# EAGLE design horizontal_driver (EAGLE 8.5.2)
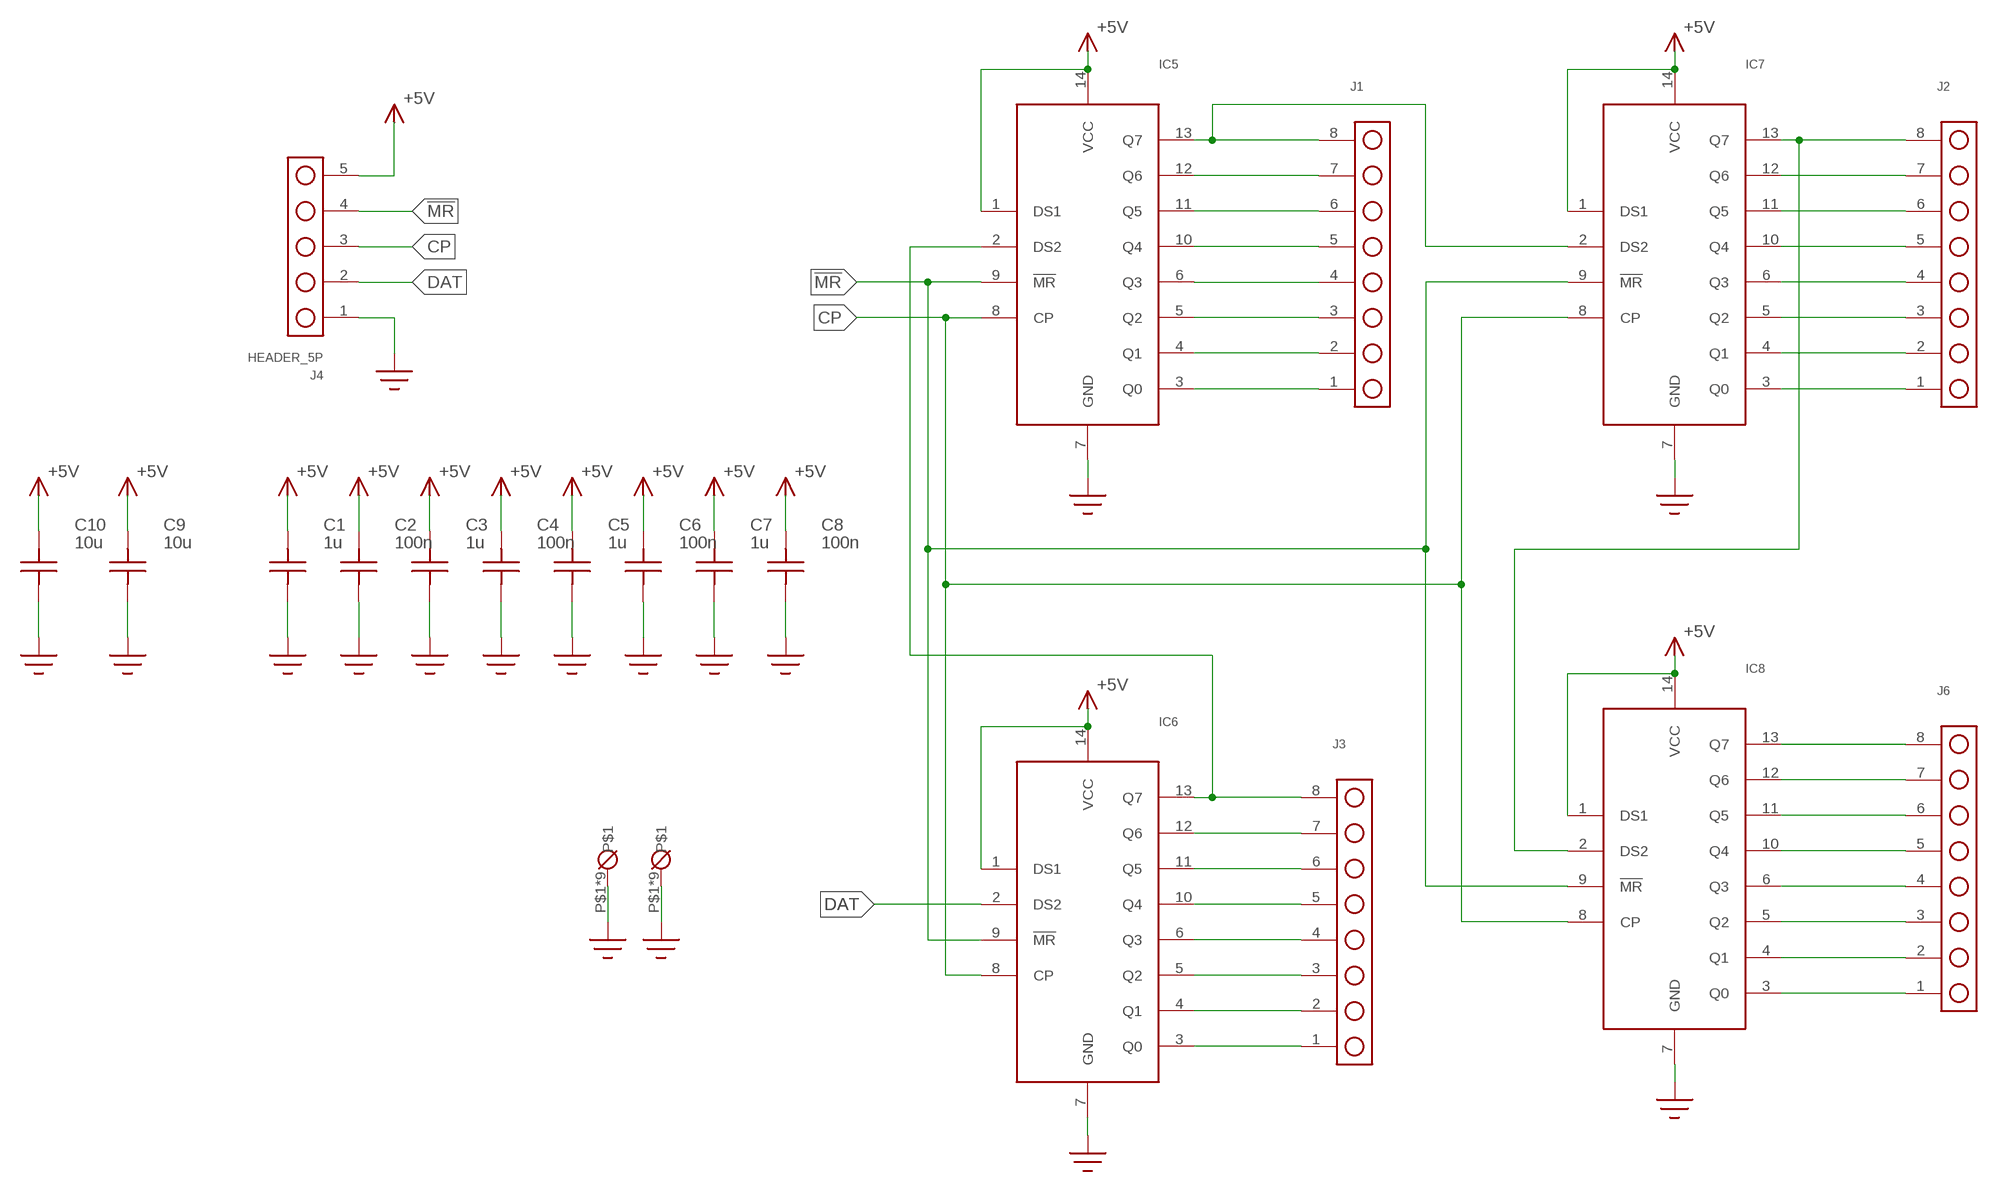
[diagram p0: schematic, sheet 1]

## Parts
C1  1u  C0805  [0805]
C2  100n  C0805  [0805]
C3  1u  C0805  [0805]
C4  100n  C0805  [0805]
C5  1u  C0805  [0805]
C6  100n  C0805  [0805]
C7  1u  C0805  [0805]
C8  100n  C0805  [0805]
C9  10u  C1206  [1206]
C10  10u  C1206  [1206]
IC5  74XX164  [SOIC-14]
IC6  74XX164  [SOIC-14]
IC7  74XX164  [SOIC-14]
IC8  74XX164  [SOIC-14]
J1  HEADER_8P  [HEADER_8P]
J2  HEADER_8P  [HEADER_8P]
J3  HEADER_8P  [HEADER_8P]
J4  HEADER_5P  [HEADER_5P]
J6  HEADER_8P  [HEADER_8P]
U$1  MOUNTING_HOLE  [MOUNTING_HOLE_#4]
U$2  MOUNTING_HOLE  [MOUNTING_HOLE_#4]

## Nets
!MR!: IC5.9(!MR!) IC6.9(!MR!) IC7.9(!MR!) IC8.9(!MR!) J4.4
+5V: C1.P$2 C2.P$2 C3.P$2 C4.P$2 C5.P$2 C6.P$2 C7.P$2 C8.P$2 C9.P$2 C10.P$2 IC5.1(DS1) IC5.14(VCC) IC6.1(DS1) IC6.14(VCC) IC7.1(DS1) IC7.14(VCC) IC8.1(DS1) IC8.14(VCC) J4.5
C0: IC6.3(Q0) J3.1
C1: IC6.4(Q1) J3.2
C2: IC6.5(Q2) J3.3
C3: IC6.6(Q3) J3.4
C4: IC6.10(Q4) J3.5
C5: IC6.11(Q5) J3.6
C6: IC6.12(Q6) J3.7
C7: IC5.2(DS2) IC6.13(Q7) J3.8
C8: IC5.3(Q0) J1.1
C9: IC5.4(Q1) J1.2
C10: IC5.5(Q2) J1.3
C11: IC5.6(Q3) J1.4
C12: IC5.10(Q4) J1.5
C13: IC5.11(Q5) J1.6
C14: IC5.12(Q6) J1.7
C15: IC5.13(Q7) IC7.2(DS2) J1.8
C16: IC7.3(Q0) J2.1
C17: IC7.4(Q1) J2.2
C18: IC7.5(Q2) J2.3
C19: IC7.6(Q3) J2.4
C20: IC7.10(Q4) J2.5
C21: IC7.11(Q5) J2.6
C22: IC7.12(Q6) J2.7
C23: IC7.13(Q7) IC8.2(DS2) J2.8
C24: IC8.3(Q0) J6.1
C25: IC8.4(Q1) J6.2
C26: IC8.5(Q2) J6.3
C27: IC8.6(Q3) J6.4
C28: IC8.10(Q4) J6.5
C29: IC8.11(Q5) J6.6
C30: IC8.12(Q6) J6.7
C31: IC8.13(Q7) J6.8
CP: IC5.8(CP) IC6.8(CP) IC7.8(CP) IC8.8(CP) J4.3
DAT: IC6.2(DS2) J4.2
GND: C1.P$1 C2.P$1 C3.P$1 C4.P$1 C5.P$1 C6.P$1 C7.P$1 C8.P$1 C9.P$1 C10.P$1 IC5.7(GND) IC6.7(GND) IC7.7(GND) IC8.7(GND) J4.1 U$1.P$1 U$1.P$2 U$1.P$3 U$1.P$4 U$1.P$5 U$1.P$6 U$1.P$7 U$1.P$8 U$1.P$9 U$2.P$1 U$2.P$2 U$2.P$3 U$2.P$4 U$2.P$5 U$2.P$6 U$2.P$7 U$2.P$8 U$2.P$9

## Library data of the parts
C1-C10 = led_oscilloscope:C
IC5-IC8 = led_oscilloscope:74XX164
J1-J3 J6 = led_oscilloscope:HEADER_8P
J4 = led_oscilloscope:HEADER_5P
U$1 U$2 = led_oscilloscope:MOUNTING_HOLE

## Board
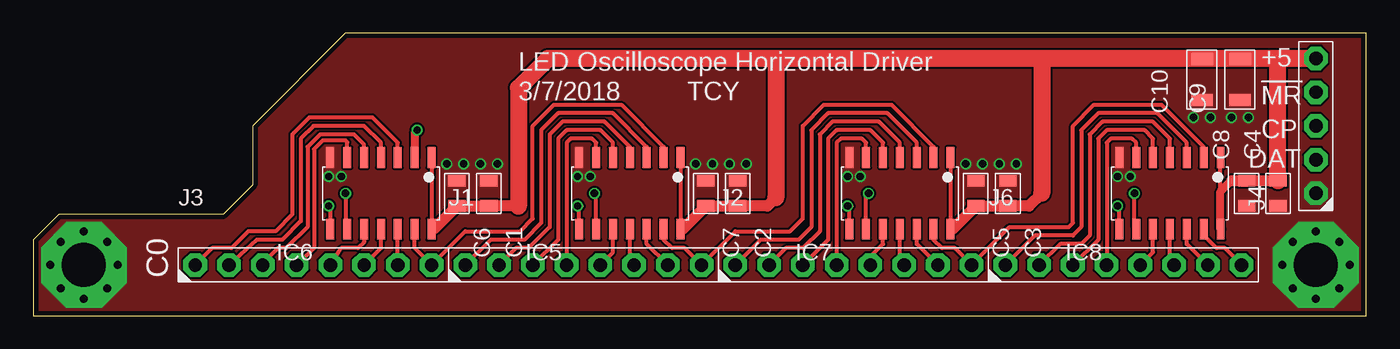
[diagram p1: board, top side]
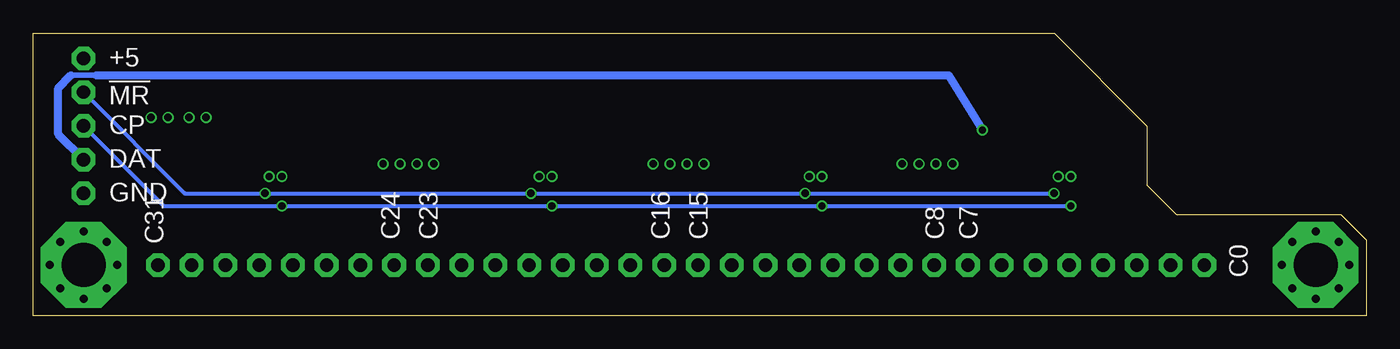
[diagram p2: board, bottom side, seen from below]

Size 100.31 x 21.27 mm. Coordinates in mm from the lower left corner, seen from the top.
Outline: 0,0 100.31,0 100.31,21.26 30.8,21.27 23.48,21.26 16.51,14.28 16.51,9.84 14.29,7.62 1.91,7.62 0,5.71 0,0
Copper layers (1*16): Top 0.035559375mm / dielectric 1.6mm / Bottom 0.035559375mm
Design rules "oshpark-2layer": minimum track width 6mil, minimum drill 10mil, track to track 6mil, track to pad 6mil, pad to pad 6mil, via to via 6mil, smd to smd 6mil, copper to edge 15mil, drill to drill 6mil, minimum pad ring 5mil, minimum via ring 5mil, stop-mask expansion 2.5mil, vias tented up to drill 0mil, thermal gap 10mil

### Footprints (pad centres in the part's own frame; a part is rotated, then mirrored left to right if it is on the bottom)
0805 = smd 0.9 x 1.3: P$1 -0.95,0; P$2 0.95,0
1206 = smd 0.9 x 1.6: P$1 -1.55,0; P$2 1.55,0
SOIC-14 = smd 0.6 x 1.55: 1 -3.81,-2.7; 2 -2.54,-2.7; 3 -1.27,-2.7; 4 0,-2.7; 5 1.27,-2.7; 6 2.54,-2.7; 7 3.81,-2.7; 8 3.81,2.7; 9 2.54,2.7; 10 1.27,2.7; 11 0,2.7; 12 -1.27,2.7; 13 -2.54,2.7; 14 -3.81,2.7
HEADER_8P = drill 1 pad 1.778 octagon: 1 -8.89,0; 2 -6.35,0; 3 -3.81,0; 4 -1.27,0; 5 1.27,0; 6 3.81,0; 7 6.35,0; 8 8.89,0
HEADER_5P = drill 1 pad 1.778 octagon: 1 -5.08,0; 2 -2.54,0; 3 0,0; 4 2.54,0; 5 5.08,0
MOUNTING_HOLE_#4 = drill 3.302 pad 6.452 octagon: P$1 0,0 | drill 0.6 pad 0.813 octagon: P$2 0,2.54; P$3 -2.54,0; P$4 2.54,0; P$5 0,-2.54; P$6 -1.746,1.746; P$7 1.746,1.746; P$8 -1.746,-1.746; P$9 1.746,-1.746

### Placement (x,y rotation side)
C1  34.29,9.21 270 top
C2  53.02,9.21 270 top
C3  73.34,9.21 270 top
C4  93.66,9.21 90 top
C5  70.93,9.21 270 top
C6  31.88,9.21 270 top
C7  50.61,9.21 270 top
C8  91.31,9.21 90 top
C9  90.81,17.78 90 top
C10  87.95,17.78 90 top
IC5  44.89,9.21 180 top
IC6  26.16,9.21 180 top
IC7  65.21,9.21 180 top
IC8  85.53,9.21 180 top
J1  41.4,3.81 0 top
J2  61.72,3.81 0 top
J3  21.08,3.81 0 top
J4  96.52,14.29 90 top
J6  82.04,3.81 0 top
U$1  3.81,3.81 0 top
U$2  96.52,3.81 90 top

### Tracks (layer width: path | path; a pad name or v marks a point on that pad's centre or on a via)
!MR!  (via drill 0.55)
  Top 0.305: v23.5,9.21 23.5,6.63 IC6.9 | IC5.9 42.35,9.08 v42.23,9.21 | IC7.9 62.67,9.02 v62.87,9.21 | IC8.9 82.87,6.63 v82.87,9.21
  Bottom 0.305: J4.4 88.9,9.21 v82.87,9.21 v62.87,9.21 v42.23,9.21 v23.5,9.21
+5V
  Top 0.305: IC6.1 IC6.14 30.13,6.51 | IC7.1 IC7.14 69.18,6.51 | IC5.1 IC5.14 48.86,6.51 | IC8.1 IC8.14 89.5,6.51
  Top 0.61: IC8.14 89.34,9.34 90.17,10.16
  Top 0.813: 30.13,6.51 C6.P$2 C1.P$2 36.51,8.26 | 69.18,6.51 C5.P$2 C3.P$2 74.93,8.26 75.88,9.21 | 48.86,6.51 C7.P$2 C2.P$2 55.25,8.26 55.88,8.89 | 90.17,10.16 C8.P$2 C4.P$2
  Top 1.016: C10.P$2 87.98,19.37 90.81,19.37 | C9.P$2 90.84,19.37 93.66,19.37
  Top 1.27: J4.5 93.66,19.37 | 93.66,19.37 90.81,19.37 75.88,19.37 | 75.88,19.37 55.88,19.37 | 55.88,19.37 38.73,19.37 36.51,17.14 36.51,8.26 | 55.88,19.37 55.88,8.89 | 75.88,19.37 75.88,9.21 | C4.P$2 93.66,19.37
C0
  Top 0.305: IC6.3 27.43,13.02 25.53,14.92 20.77,14.92 19.49,13.65 19.49,7.62 18.22,6.35 16.19,6.35 14.92,5.08 13.46,5.08 J3.1
C1
  Top 0.305: IC6.4 26.16,13.02 24.89,14.29 21.08,14.29 20.13,13.34 20.13,7.11 18.73,5.71 16.83,5.71 J3.2
C2
  Top 0.305: IC6.5 24.89,12.89 24.13,13.65 21.59,13.65 20.64,12.7 20.64,6.67 19.05,5.08 18.41,5.08 17.27,3.94 J3.3
C3
  Top 0.305: IC6.6 23.62,13.07 23.5,13.2 21.78,13.2 21.12,12.54 21.12,5.12 J3.4
C4
  Top 0.305: IC6.10 24.89,5.52 24.45,5.08 23.18,5.08 J3.5
C5
  Top 0.305: J3.6 26.16,5.08 IC6.11
C6
  Top 0.305: J3.7 IC6.12
C7
  Top 0.305: IC5.2 47.43,12.7 44.26,15.88 39.18,15.88 37.59,14.29 37.59,7.3 36.64,6.35 32.51,6.35 J3.8 28.7,5.08 IC6.13
C8
  Top 0.305: IC5.3 46.16,12.7 43.62,15.24 39.5,15.24 38.23,13.97 38.23,6.99 36.96,5.71 34.42,5.71 J1.1
C9
  Top 0.305: IC5.4 44.9,12.7 42.99,14.61 39.81,14.61 38.86,13.65 38.86,6.67 37.27,5.08 36.32,5.08 J1.2
C10
  Top 0.305: IC5.5 43.62,13.02 42.67,13.97 40.13,13.97 39.5,13.34 39.5,5.71 J1.3
C11
  Top 0.305: IC5.6 42.35,13.02 42.04,13.34 40.45,13.34 40.13,13.02 J1.4
C12
  Top 0.305: J1.5 43.62,4.76 IC5.10
C13
  Top 0.305: J1.6 44.9,4.76 IC5.11
C14
  Top 0.305: J1.7 46.16,5.4 IC5.12
C15
  Top 0.305: IC7.2 67.75,12.7 64.58,15.88 59.5,15.88 57.91,14.29 57.91,7.3 56.96,6.35 52.83,6.35 J1.8 49.02,5.08 48.07,5.08 47.43,5.71 IC5.13
C16
  Top 0.305: IC7.3 66.48,13.02 64.26,15.24 59.82,15.24 58.55,13.97 58.55,6.67 57.59,5.71 54.74,5.71 J2.1
C17
  Top 0.305: IC7.4 65.22,13.02 63.63,14.61 60.13,14.61 59.18,13.65 59.18,6.35 57.91,5.08 56.64,5.08 J2.2
C18
  Top 0.305: IC7.5 63.94,13.02 62.99,13.97 60.45,13.97 59.82,13.34 59.82,5.71 J2.3
C19
  Top 0.305: IC7.6 62.67,13.02 62.36,13.34 60.77,13.34 60.45,13.02 J2.4
C20
  Top 0.305: J2.5 62.99,4.45 63.94,5.4 IC7.10
C21
  Top 0.305: J2.6 65.22,4.45 IC7.11
C22
  Top 0.305: J2.7 66.48,5.4 IC7.12
C23
  Top 0.305: IC8.2 88.08,12.7 84.9,15.88 79.82,15.88 78.23,14.29 78.23,6.99 77.92,6.67 73.47,6.67 J2.8 69.34,5.08 68.39,5.08 67.75,5.71 IC7.13
C24
  Top 0.305: IC8.3 86.81,13.02 84.58,15.24 80.14,15.24 78.87,13.97 78.87,6.67 78.23,6.03 75.37,6.03 J6.1
C25
  Top 0.305: IC8.4 85.53,13.34 84.26,14.61 80.45,14.61 79.5,13.65 79.5,6.03 78.87,5.4 77.28,5.4 J6.2
C26
  Top 0.305: IC8.5 84.26,13.34 83.63,13.97 80.77,13.97 80.14,13.34 80.14,5.71 J6.3
C27
  Top 0.305: IC8.6 83,13.02 82.68,13.34 81.09,13.34 80.77,13.02 J6.4
C28
  Top 0.305: J6.5 84.26,4.76 IC8.10
C29
  Top 0.305: J6.6 85.53,4.13 IC8.11
C30
  Top 0.305: J6.7 86.81,5.4 IC8.12
C31
  Top 0.305: J6.8 89.66,5.08 89.03,5.08 88.08,6.03 IC8.13
CP  (via drill 0.55)
  Top 0.305: v22.23,8.26 22.35,8.13 IC6.8 | IC5.8 41.08,8.06 41.27,8.26 v40.96,8.26 | IC7.8 61.4,8.06 61.59,8.26 v61.28,8.26 | IC8.8 81.72,8.13 v81.6,8.26
  Bottom 0.305: J4.3 90.49,8.26 v81.6,8.26 v61.28,8.26 v40.96,8.26 v22.23,8.26
DAT  (via drill 0.55)
  Top 0.61: v28.89,13.97 28.7,13.78 IC6.2
  Bottom 0.406: 97.47,18.1 95.57,18.1
  Bottom 0.61: J4.2 98.42,13.65 98.42,17.14 97.47,18.1 | 95.57,18.1 31.43,18.1 v28.89,13.97
GND  (via drill 0.55)
  other vias: 22.23,10.48 40.96,10.48 61.28,10.48 81.6,10.48 82.55,10.48 62.23,10.48 41.91,10.48 23.18,10.48 31.11,11.43 32.38,11.43 33.66,11.43 34.92,11.43 49.85,11.43 51.12,11.43 52.39,11.43 53.66,11.43 70.17,11.43 71.44,11.43 72.71,11.43 73.98,11.43 91.44,14.92 90.17,14.92 87.31,14.92 88.58,14.92
  pour Top (no thermals): 0,0 100.33,0 100.33,21.27 0,21.27

### Text on the board
tPlace: +5 | LED Oscilloscope Horizontal Driver | 3/7/2018 | TCY | !MR! | CP | DAT | C0
bPlace: +5 | !MR! | CP | DAT | GND | C7 | C8 | C15 | C16 | C23 | C24 | C31 | C0